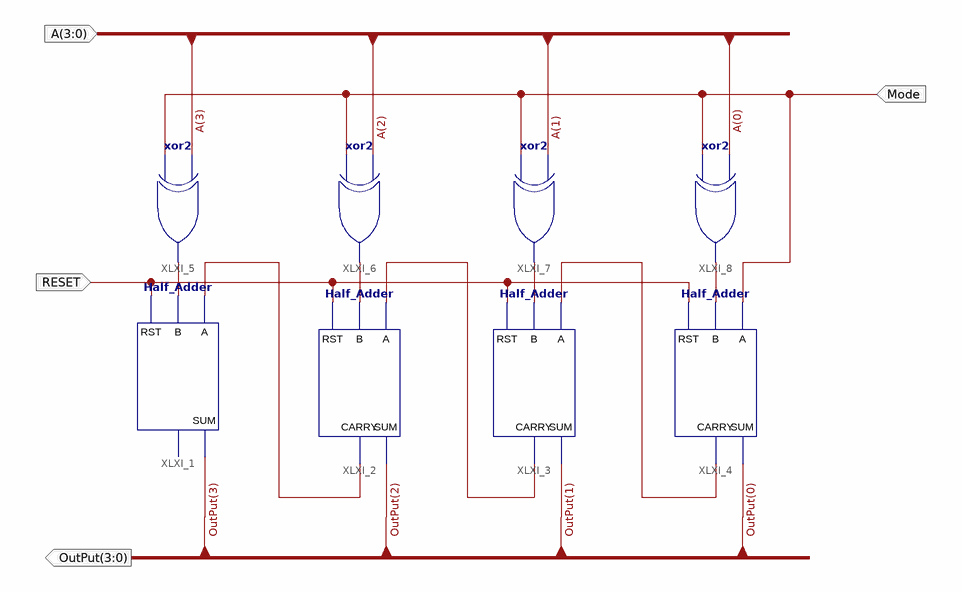
[diagram p0: schematic sheet 1]
// Xilinx ISE schematic Adder_with_2s_Complement.sch (spartan6) as structural Verilog: 8 symbols, 4 ports
module Adder_with_2s_Complement (
  input  RESET,
  input  Mode,
  input  [3:0] A,
  output [3:0] OutPut
);

  wire XLXN_1, XLXN_2, XLXN_3, XLXN_4, XLXN_6, XLXN_8, XLXN_10;

  Half_Adder XLXI_1 (.A(XLXN_6), .B(XLXN_1), .RST(RESET), .SUM(OutPut[3]));  // open: CARRY
  Half_Adder XLXI_2 (.A(XLXN_8), .B(XLXN_2), .CARRY(XLXN_6), .RST(RESET), .SUM(OutPut[2]));
  Half_Adder XLXI_3 (.A(XLXN_10), .B(XLXN_3), .CARRY(XLXN_8), .RST(RESET), .SUM(OutPut[1]));
  Half_Adder XLXI_4 (.A(Mode), .B(XLXN_4), .CARRY(XLXN_10), .RST(RESET), .SUM(OutPut[0]));
  xor XLXI_5 (XLXN_1, Mode, A[3]);
  xor XLXI_6 (XLXN_2, Mode, A[2]);
  xor XLXI_7 (XLXN_3, Mode, A[1]);
  xor XLXI_8 (XLXN_4, Mode, A[0]);
endmodule
